# EAGLE design wetl (EAGLE 6.5.0)
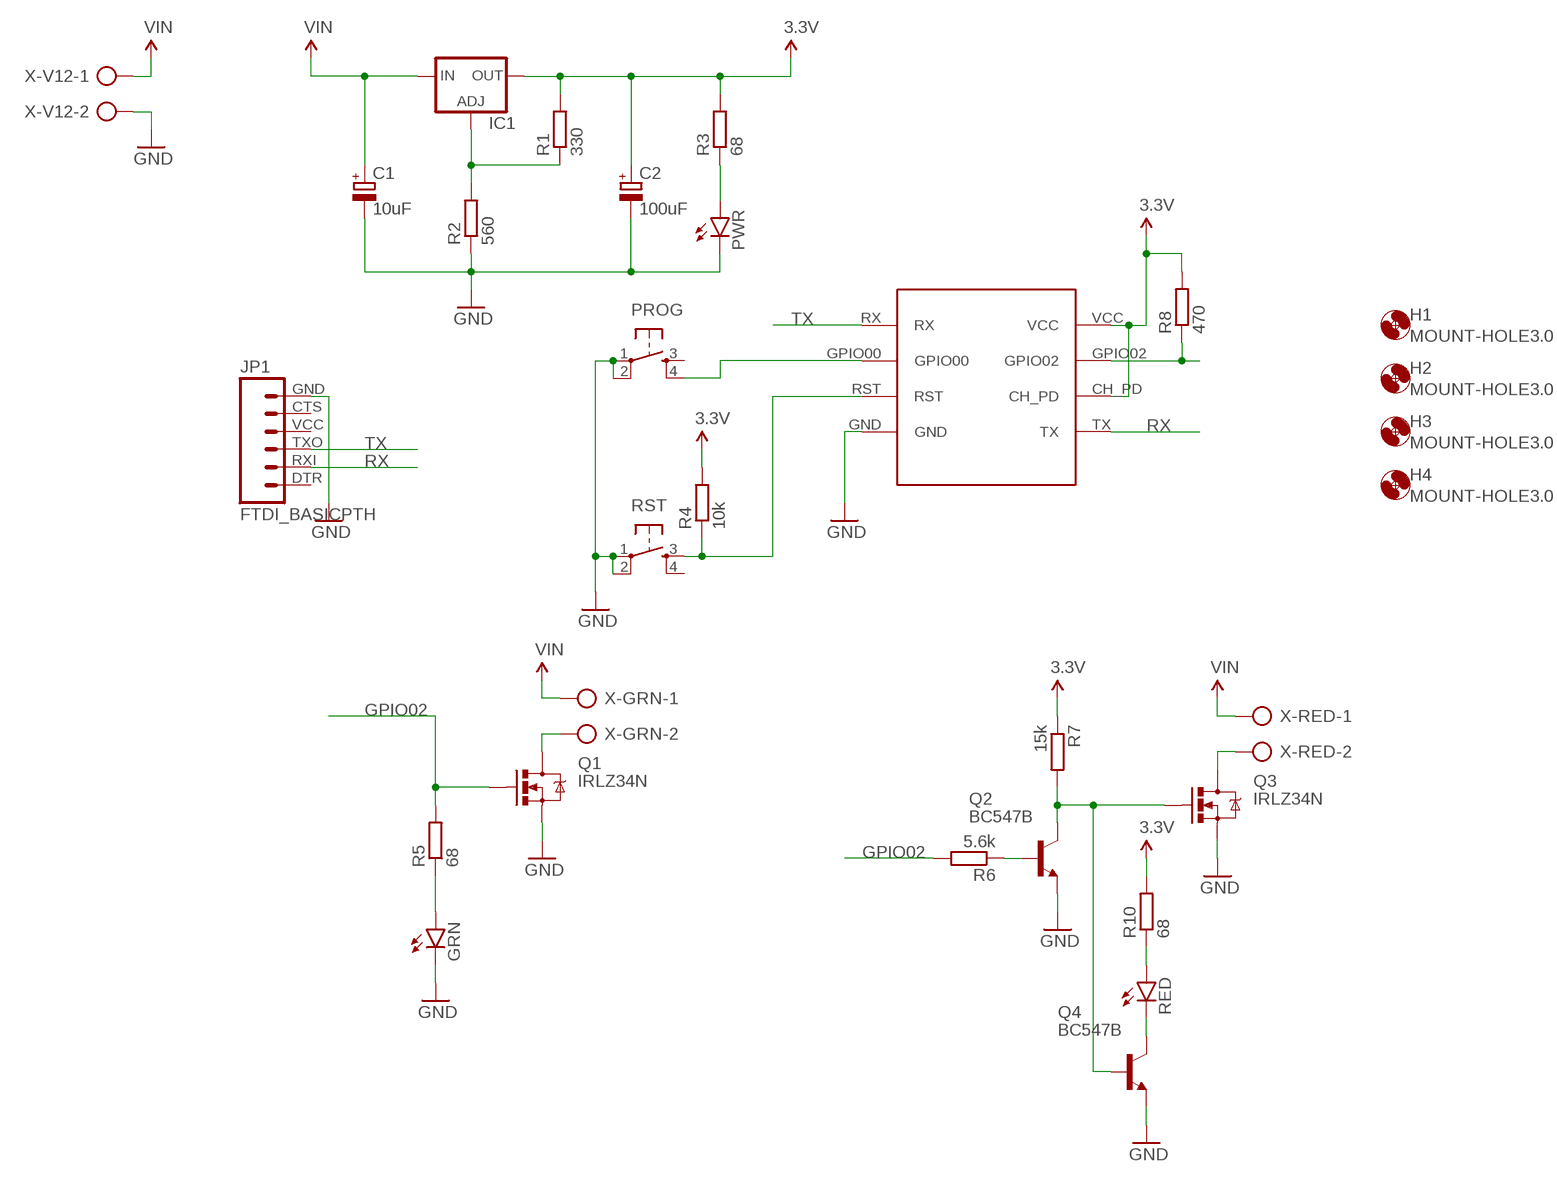
[diagram p0: schematic, sheet 1]

## Parts
C1  10uF  CPOL-EUE2.5-6  [E2,5-6]
C2  100uF  CPOL-EUE2.5-6  [E2,5-6]
GRN  LED5MM  [LED5MM]
H1  MOUNT-HOLE3.0  [3,0]
H2  MOUNT-HOLE3.0  [3,0]
H3  MOUNT-HOLE3.0  [3,0]
H4  MOUNT-HOLE3.0  [3,0]
IC1  LM317TS  [317TS]
JP1  FTDI_BASICPTH  [FTDI_BASIC]
PROG  TAC_SWITCHPTH  [TACTILE-PTH]
PWR  LED5MM  [LED5MM]
Q1  IRLZ34N  MOSFET-NCHANNELFQP30N06L  [TO220V]
Q2  BC547B  [TO92]
Q3  IRLZ34N  MOSFET-NCHANNELFQP30N06L  [TO220V]
Q4  BC547B  [TO92]
R1  330  R-EU_0204/2V  [0204V]
R2  560  R-EU_0204/2V  [0204V]
R3  68  R-EU_0204/2V  [0204V]
R4  10k  R-EU_0204/7  [0204/7]
R5  68  R-EU_0204/2V  [0204V]
R6  5.6k  R-EU_0204/2V  [0204V]
R7  15k  R-EU_0204/2V  [0204V]
R8  470  R-EU_0204/7  [0204/7]
R10  68  R-EU_0204/2V  [0204V]
RED  LED5MM  [LED5MM]
RST  TAC_SWITCHPTH  [TACTILE-PTH]
U$2  ESP8266  [ESP-01]
X-GRN  SMKDSP_1,5/2  [SMKDSP_1,5/2]
X-RED  SMKDSP_1,5/2  [SMKDSP_1,5/2]
X-V12  SMKDSP_1,5/2  [SMKDSP_1,5/2]

## Nets
3.3V: C2.+ IC1.2(OUT) R1.2 R3.2 R4.2 R7.1 R8.2 R10.2 U$2.CH_PD U$2.VCC
GND: C1.- C2.- GRN.K(C) JP1.GND PROG.1 PROG.2 PWR.K(C) Q1.3(S) Q2.1(E) Q3.3(S) Q4.1(E) R2.1 RST.1 RST.2 U$2.GND X-V12.2
GPIO02: Q1.1(G) R5.2 R6.2 R8.1 U$2.GPIO02
N$1: GRN.A R5.1
N$2: IC1.1(ADJ) R1.1 R2.2
N$3: R10.1 RED.A
N$4: Q3.2(D) X-RED.2
N$5: PWR.A R3.1
N$6: R4.1 RST.3 U$2.RST
N$7: Q1.2(D) X-GRN.2
N$8: Q2.3(C) Q3.1(G) Q4.2(B) R7.2
N$9: Q2.2(B) R6.1
N$10: Q4.3(C) RED.K(C)
N$11: PROG.4 U$2.GPIO00
RX: JP1.RXI U$2.TX
TX: JP1.TXO U$2.RX
VIN: C1.+ IC1.3(IN) X-GRN.1 X-RED.1 X-V12.1
Unconnected: JP1.CTS JP1.DTR JP1.VCC PROG.3 RST.4

## Library data of the parts
C1 C2 = resistor:CPOL-EU: POLARIZED CAPACITOR, European symbol
GRN PWR RED = SparkFun-LED:LED: LEDs Standard schematic elements and footprints for 5mm, 3mm, 1206, and 0603 sized LEDs. 5mm - Spark Fun Electronics SKU : COM-00529 (and others)
H1-H4 = holes:MOUNT-HOLE: MOUNTING HOLE with drill center marker
IC1 = v-reg:LM317TS: VOLTAGE REGULATOR
JP1 = SparkFun-Connectors:FTDI_BASIC: FTDI Basic header with labels
PROG RST = SparkFun-Electromechanical:TAC_SWITCH: Momentary Switch Button commonly used for reset or general input. Spark Fun Electronics SKU : COM-00097 SMT- SWCH-08247
Q1 Q3 = SparkFun-DiscreteSemi:MOSFET-NCHANNEL: Common NMOSFET Parts MFG P/N Store ID Prod ID FDD8780 TRANS-09984 SI7820DN TRANS-11055 FDS6630A IC-08089 2N7002PW TRANS-11151 FQP30N06L COM-10213 TRANS-10060 BSS123LT1G TRANS-08345 BSS138 TRANS-00830 BS170 2N7000; PROD_ID: TRANS-10060
Q2 Q4 = transistor-npn:BC547*: NPN Transistor
R1-R8 R10 = resistor:R-EU_: RESISTOR, European symbol
U$2 = wetl:ESP8266
X-GRN X-RED X-V12 = con-phoenix-smkdsp:SMKDSP_1,5/2: Printklemme, Nennstrom: 17,5 A, Bemessungsspannung: 250 V, Raster: 5,0 mm Source: http://eshop.phoenixcontact.de .. 1733415.pdf; MF: FARNELL; MPN: 1733570; OC_FARNELL: 3041244; OC_NEWARK: 69C8588

## Board
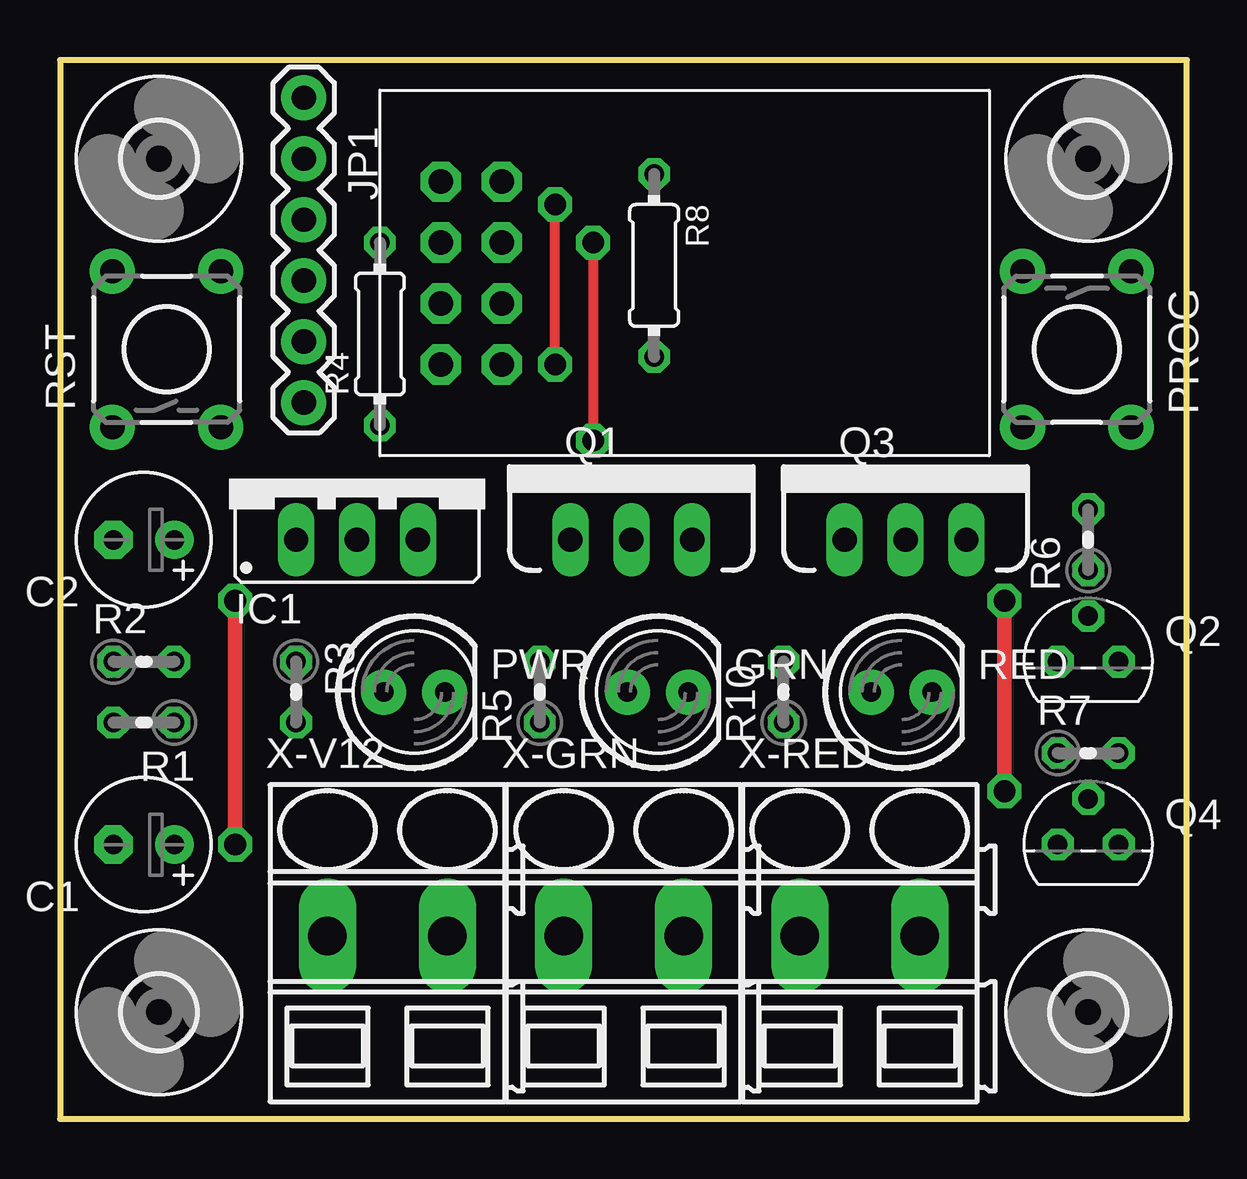
[diagram p1: board, top side]
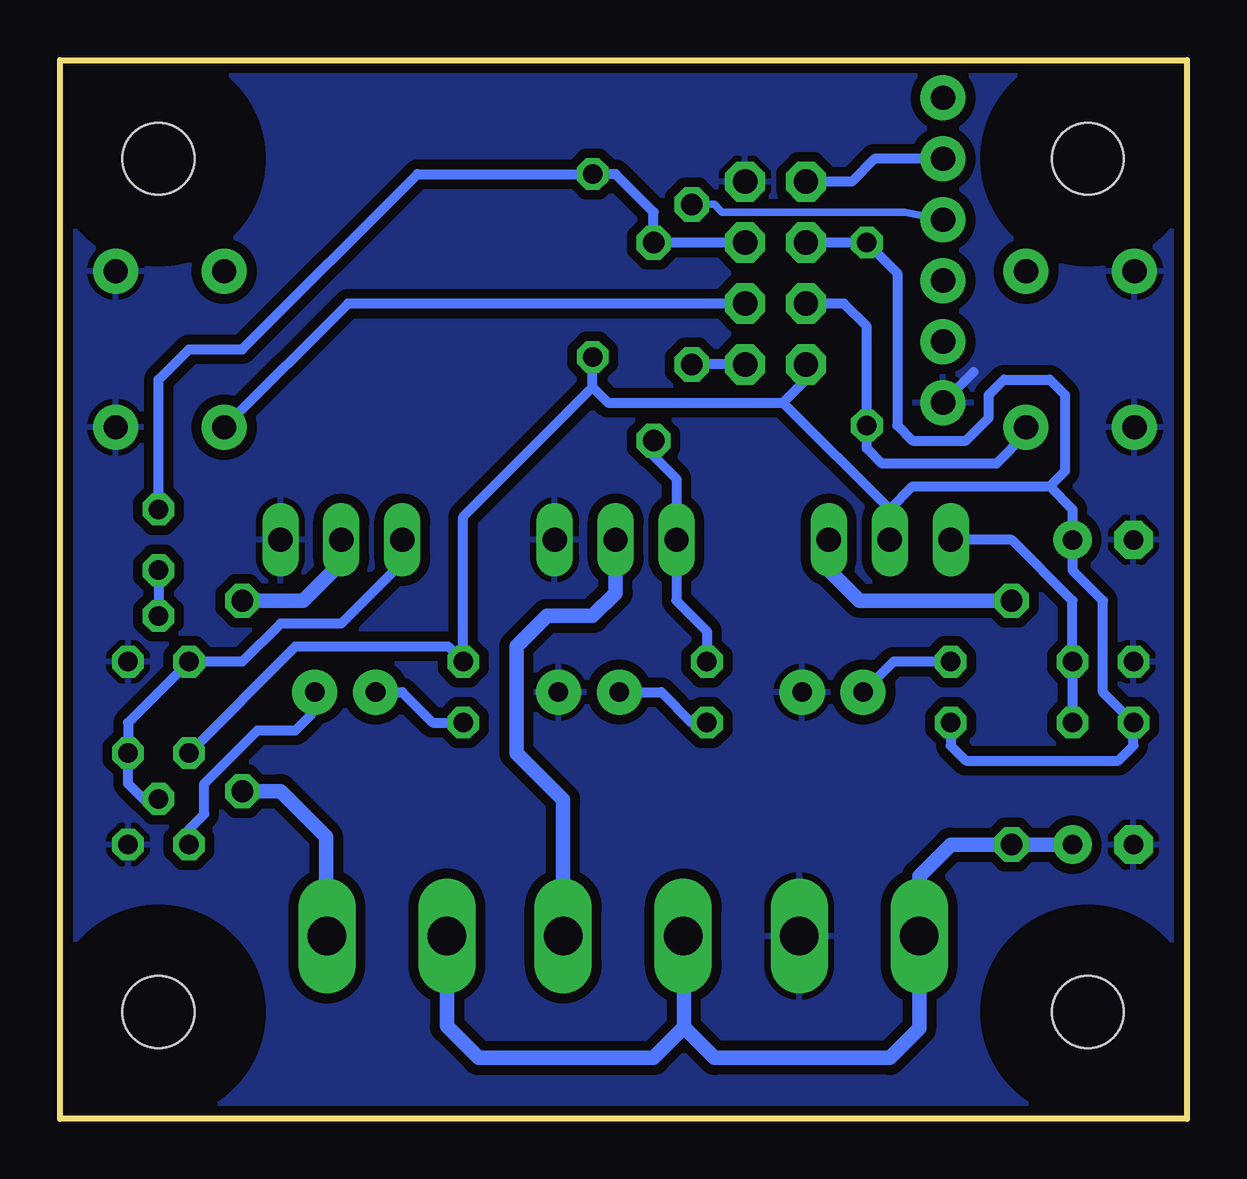
[diagram p2: board, bottom side, seen from below]

Size 46.97 x 44.12 mm. Coordinates in mm from the lower left corner, seen from the top.
Outline: 0,0 46.97,0 46.97,44.12 0,44.12 0,0
Copper layers (1*16): Top 0.035mm / dielectric 1.5mm / Bottom 0.035mm
Design rules "default *": minimum track width 10mil, minimum drill 24mil, track to track 16mil, track to pad 16mil, pad to pad 16mil, via to via 16mil, smd to smd 8mil, copper to edge 10mil, drill to drill 8mil, minimum pad ring 10mil, minimum via ring 8mil, stop-mask expansion 4mil, vias tented up to drill 0mil, thermal gap 10mil

### Footprints (pad centres in the part's own frame; a part is rotated, then mirrored left to right if it is on the bottom)
E2,5-6 = drill 0.813 pad 1.6: + -1.27,0 | drill 0.813 pad 1.6 octagon: - 1.27,0
LED5MM = drill 0.813 pad 1.88: A -1.27,0; K 1.27,0
3,0 = hole 3: 0,0
317TS = drill 1.016 long: 1 -2.54,-2.54; 2 0,-2.54; 3 2.54,-2.54
FTDI_BASIC = drill 1.016 pad 1.88: CTS 10.16,0; DTR 0,0; GND 12.7,0; RXI 2.54,0; TXO 5.08,0; VCC 7.62,0
TACTILE-PTH = drill 1.016 pad 1.88: 1 -3.251,2.261; 2 3.251,2.261; 3 -3.251,-2.261; 4 3.251,-2.261
TO220V = drill 1.016 long: 1 -2.54,0; 2 0,0; 3 2.54,0
TO92 = drill 0.813 octagon: 1 1.27,0; 2 0,1.905; 3 -1.27,0
0204V = drill 0.813 octagon: 1 -1.27,0; 2 1.27,0
0204/7 = drill 0.813 octagon: 1 -3.81,0; 2 3.81,0
ESP-01 = drill 1.016 pad 1.676 octagon: CH_PD -1.27,-1.27; GND -3.81,1.27; GPIO00 1.27,1.27; GPIO02 -1.27,1.27; RST 1.27,-1.27; RX 3.81,1.27; TX -3.81,-1.27; VCC 3.81,-1.27
SMKDSP_1,5/2 = drill 1.6 pad 1.8 long: 1 -2.5,0; 2 2.5,0

### Placement (x,y rotation side)
C1  3.49,11.43 180 top
C2  3.49,24.13 180 top
GRN  24.92,17.78 0 top
H1  4.13,4.45 0 top
H2  42.86,4.45 0 top
H3  4.13,40.01 0 top
H4  42.86,40.01 0 top
IC1  12.38,26.67 0 top
JP1  10.16,42.55 270 top
PROG  42.39,32.07 270 top
PWR  14.76,17.78 0 top
Q1  23.81,24.13 0 top
Q2  42.86,19.05 0 top
Q3  35.24,24.13 0 top
Q4  42.86,11.43 0 top
R1  3.49,16.51 180 top
R2  3.49,19.05 0 top
R3  9.84,17.78 270 top
R4  13.33,32.7 90 top
R5  20,17.78 90 top
R6  42.86,24.13 90 top
R7  42.86,15.24 0 top
R8  24.77,35.56 270 top
R10  30.16,17.78 90 top
RED  35.08,17.78 0 top
RST  4.45,32.07 90 top
U$2  17.14,35.24 270 top
X-GRN  23.5,7.62 0 top
X-RED  33.34,7.62 0 top
X-V12  13.65,7.62 0 top

### Tracks (layer width: path | path; a pad name or v marks a point on that pad's centre or on a via)
3.3V
  Bottom 0.406: IC1.2 12.38,25.4 | 12.38,25.4 11.43,26.35 5.71,26.35 | 5.71,26.35 4.76,25.4 C2.+ 4.76,22.86 3.49,21.59 3.49,17.78 R1.2 2.22,15.56 2.86,14.92 9.21,14.92 9.84,15.56 R3.2 | 16.83,29.84 12.38,25.4 | R7.1 37.15,19.68 30.8,19.68 R10.2 30.16,25.08 24.76,30.48 | 24.76,30.48 24.13,29.84 16.83,29.84 | 24.76,30.48 R8.2 | 5.71,26.35 5.08,26.99 5.08,30.16 5.71,30.8 7.62,30.8 8.25,30.16 8.25,29.21 9.21,28.26 11.43,28.26 12.07,28.89 12.07,35.24 R4.2 U$2.CH_PD | U$2.VCC 15.87,30.8 16.83,29.84
GND
  Bottom 0.406: JP1.GND 8.89,31.11
  pour Bottom (isolate 0.406): -0.32,44.45 46.67,44.45 46.67,0 -0.32,0
GPIO02  (via drill 0.9 pad 1.42)
  Top 0.406: v22.23,36.51 v22.23,28.26
  Bottom 0.406: R5.2 20,20.32 21.27,21.59 Q1.1 21.27,26.67 22.23,27.62 v22.23,28.26 | U$2.GPIO02 v22.23,36.51 22.23,37.78 23.81,39.37 R8.1 32.07,39.37 39.37,32.07 41.59,32.07 42.86,30.8 R6.2
N$1
  Bottom 0.406: GRN.A 21.91,17.78 20.64,16.51 R5.1
N$2
  Bottom 0.406: R1.1 R2.2 4.76,21.59 7.3,24.13 IC1.1
N$3
  Bottom 0.406: RED.A 32.7,17.78 31.43,16.51 R10.1
N$4  (via drill 0.9 pad 1.42)
  Top 0.61: v39.37,21.59 v39.37,13.65
  Bottom 0.406: 35.88,7.66 X-RED.2
  Bottom 0.61: Q3.2 35.24,23.18 36.83,21.59 v39.37,21.59 | v39.37,13.65 37.78,13.65 35.88,11.75 35.88,7.66
N$5
  Bottom 0.406: R3.1 12.22,19.05 PWR.A
N$6
  Bottom 0.406: U$2.RST 14.29,33.97 13.33,33.02 R4.1 13.33,27.94 12.7,27.3 7.94,27.3 6.71,28.54 RST.3
N$7
  Bottom 0.61: X-GRN.2 25.99,13.29 27.94,15.24 27.94,19.68 26.67,20.95 24.76,20.95 23.81,21.91 Q1.2
N$8
  Bottom 0.406: Q4.2 43.5,13.34 44.13,13.97 R7.2 44.13,16.51 Q2.3 39.37,19.05 37.78,20.64 35.24,20.64 32.7,23.18 Q3.1
N$9
  Bottom 0.406: R6.1 Q2.2
N$10
  Bottom 0.406: Q4.3 41.59,12.06 40.96,12.7 40.96,13.97 38.74,16.19 37.15,16.19 36.51,16.83 RED.K
N$11
  Bottom 0.406: U$2.GPIO00 34.97,33.97 PROG.4
RX
  Bottom 0.406: JP1.RXI 13.02,40.01 13.97,39.05 U$2.TX
TX  (via drill 0.9 pad 1.42)
  Top 0.406: v20.64,31.43 v20.64,38.1
  Bottom 0.305: v20.64,38.1 19.69,38.1 19.37,37.78 11.75,37.78 JP1.TXO
  Bottom 0.406: U$2.RX v20.64,31.43
VIN  (via drill 0.9 pad 1.42)
  Top 0.61: v7.3,21.59 v7.3,11.43
  Bottom 0.406: 20.96,7.58 X-GRN.1
  Bottom 0.61: 20.96,3.81 19.69,2.54 12.38,2.54 11.15,3.77 X-V12.1 11.15,10.12 9.84,11.43 v7.3,11.43 C1.+ | 20.96,3.81 20.96,7.58 | X-RED.1 30.84,3.85 29.53,2.54 22.23,2.54 20.96,3.81 | IC1.3 14.92,22.86 13.65,21.59 v7.3,21.59